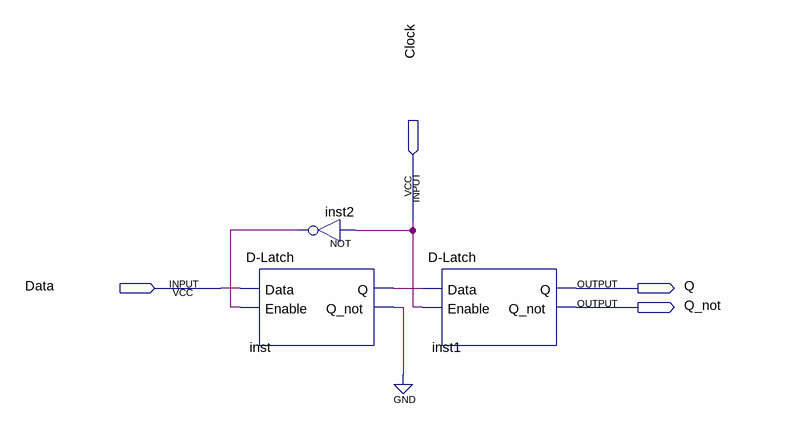
[diagram p0: schematic sheet]
// Quartus schematic D-Flip-Flop.bdf as structural Verilog: 3 symbols, 4 pins
module \D-Flip-Flop  (
  input  Clock,
  input  Data,
  output Q,
  output Q_not
);

  wire inst2_out, inst_q, inst_q_not;

  \D-Latch  inst (.Data(Data), .Enable(inst2_out), .Q(inst_q), .Q_not(inst_q_not));
  not inst2 (inst2_out, Clock);
  \D-Latch  inst1 (.Data(inst_q), .Enable(Clock), .Q(Q), .Q_not(Q_not));
  // also tied to GND on the sheet: inst_q_not
endmodule
